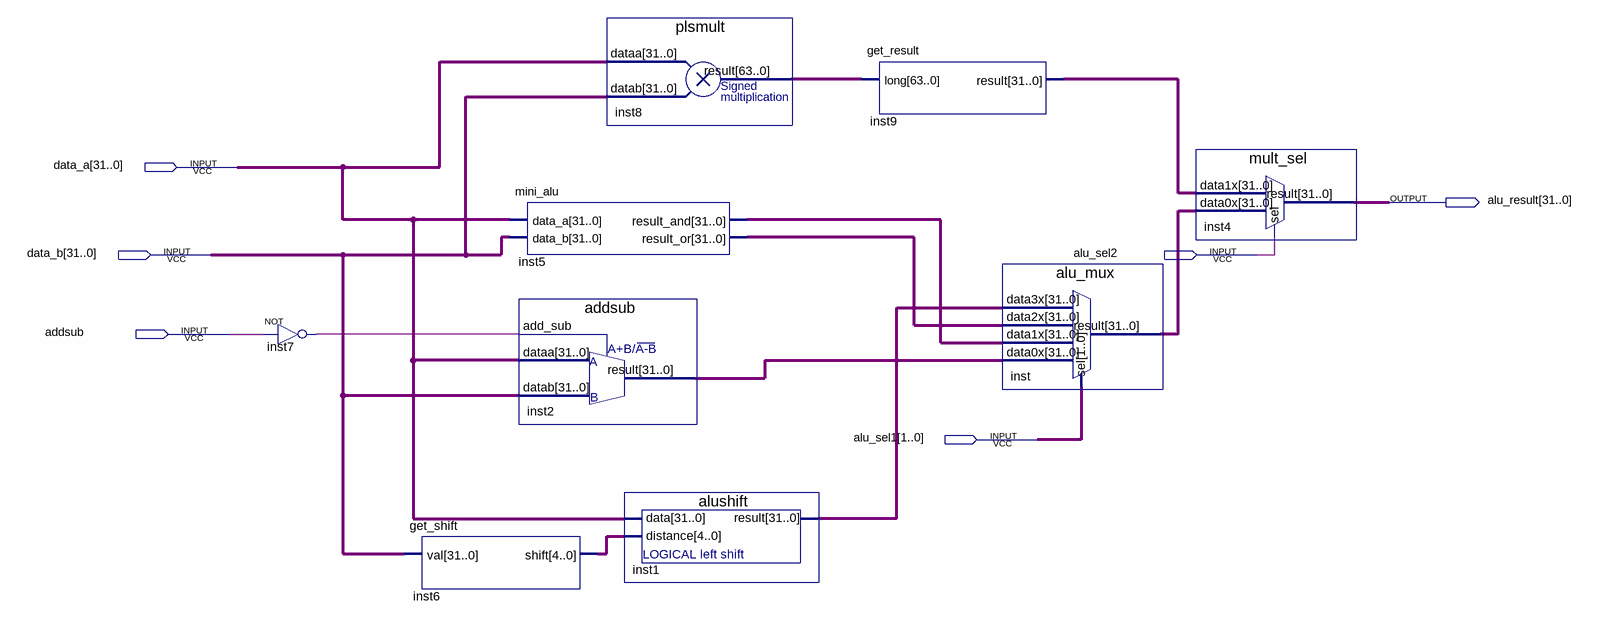
[diagram p0: schematic sheet]
// Quartus schematic alu_block.bdf as structural Verilog: 9 symbols, 6 pins
module alu_block (
  input  [31:0] data_a,
  input  [31:0] data_b,
  input  alu_sel2,
  input  addsub,
  input  [1:0] alu_sel1,
  output [31:0] alu_result
);

  wire inst7_out;
  wire [4:0] inst6_shift;
  wire [31:0] inst1_result, inst2_result, inst5_result_and, inst5_result_or, inst9_result, inst_result;
  wire [63:0] inst8_result;

  not inst7 (inst7_out, addsub);
  get_shift inst6 (.val(data_b), .shift(inst6_shift));
  mini_alu inst5 (.data_a(data_a), .data_b(data_b), .result_and(inst5_result_and), .result_or(inst5_result_or));
  addsub inst2 (.add_sub(inst7_out), .dataa(data_a), .datab(data_b), .result(inst2_result));
  plsmult inst8 (.dataa(data_a), .datab(data_b), .result(inst8_result));
  alushift inst1 (.data(data_a), .distance(inst6_shift), .result(inst1_result));
  get_result inst9 (.long(inst8_result), .result(inst9_result));
  alu_mux inst (
    .data3x(inst1_result), .data2x(inst5_result_or), .data1x(inst5_result_and), .data0x(inst2_result),
    .sel(alu_sel1), .result(inst_result));
  mult_sel inst4 (.data1x(inst9_result), .data0x(inst_result), .sel(alu_sel2), .result(alu_result));
endmodule
